# Altium schematic sheet HMI_SENSOR.SchDoc
size A4; SheetNumber: 6; SheetTotal: 6
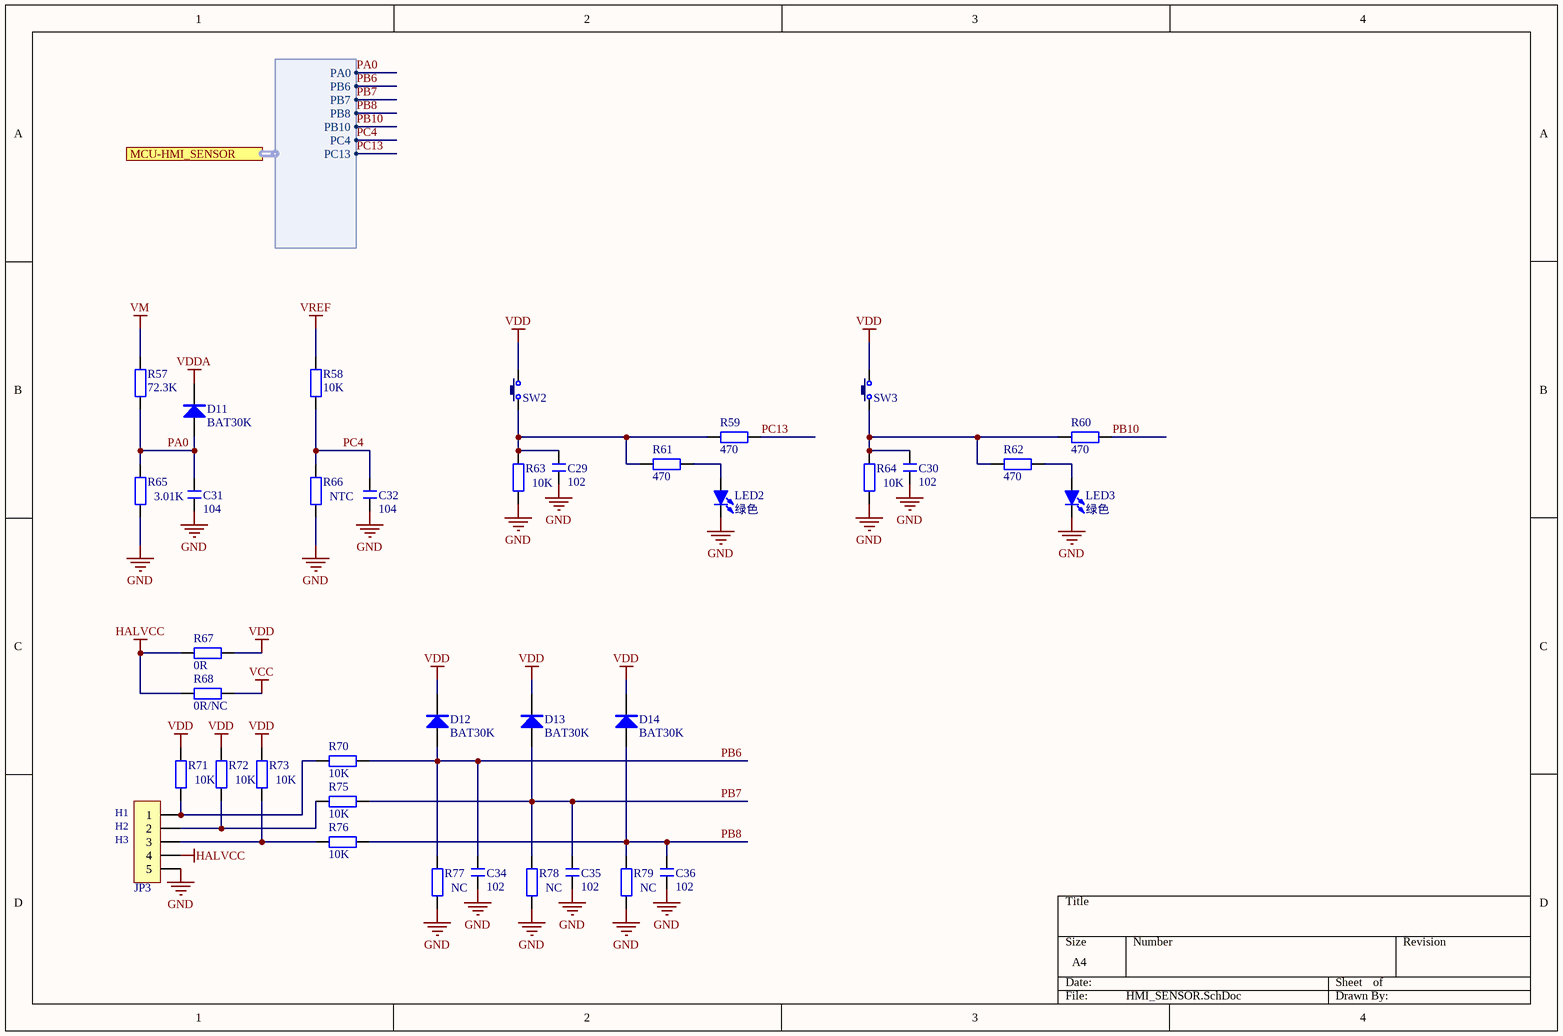
[diagram p0: HMI_SENSOR.SchDoc]

## Parts
C29  102  [C 0603_L]
C30  102  [C 0603_L]
C31  104  [C 0603_L]
C32  104  [C 0603_L]
C34  102  [C 0603_L]
C35  102  [C 0603_L]
C36  102  [C 0603_L]
D11  BAT30K  [SOD-523]
D12  BAT30K  [SOD-523]
D13  BAT30K  [SOD-523]
D14  BAT30K  [SOD-523]
JP3  HDR-1X5  [XH2.54-WI-5P]  (value not drawn)
LED2  绿色  [LED 0603G]
LED3  绿色  [LED 0603G]
R57  72.3K  [R 0603_L]
R58  10K  [R 0603_L]
R59  470  [R 0603_L]
R60  470  [R 0603_L]
R61  470  [R 0603_L]
R62  470  [R 0603_L]
R63  10K  [R 0603_L]
R64  10K  [R 0603_L]
R65  3.01K  [R 0603_L]
R66  NTC  [R 0603_M]
R67  0R  [R 0603_L]
R68  0R/NC  [R 0603_L]
R70  10K  [R 0603_L]
R71  10K  [R 0603_L]
R72  10K  [R 0603_L]
R73  10K  [R 0603_L]
R75  10K  [R 0603_L]
R76  10K  [R 0603_L]
R77  NC  [R 0603_L]
R78  NC  [R 0603_L]
R79  NC  [R 0603_L]
SW2  3x6x5  [TSW SMD-3*6*2.5]  (value not drawn)
SW3  3x6x5  [TSW SMD-3*6*2.5]  (value not drawn)

## Ports
MCU-HMI_SENSOR (harness Pow-HMI_SENSOR, see TopLevel[2D], MCU[1A])

## Harnesses
Pow-HMI_SENSOR: PA0, PB6, PB7, PB8, PB10, PC4, PC13

## Nets
GND: C29.2 C30.2 C31.2 C32.2 C34.2 C35.2 C36.2 JP3.5 LED2.2(K) LED3.2(K) R63.2 R64.2 R65.2 R66.2 R77.2 R78.2 R79.2
HALVCC: JP3.4 R67.2 R68.2
VCC: R68.1
VDD: D12.2(K) D13.2(K) D14.2(K) R67.1 R71.1 R72.1 R73.1 SW2.2 SW3.2
VDDA: D11.2(K)
VM: R57.1
VREF: R58.1
PA0: C31.1 D11.1(A) R57.2 R65.1 ; port MCU-HMI_SENSOR.PA0
PB6: C34.1 D12.1(A) R70.2 R77.1 ; port MCU-HMI_SENSOR.PB6
PB7: C35.1 D13.1(A) R75.2 R78.1 ; port MCU-HMI_SENSOR.PB7
PB8: C36.1 D14.1(A) R76.2 R79.1 ; port MCU-HMI_SENSOR.PB8
PB10: R60.2 ; port MCU-HMI_SENSOR.PB10
PC4: C32.1 R58.2 R66.1 ; port MCU-HMI_SENSOR.PC4
PC13: R59.2 ; port MCU-HMI_SENSOR.PC13
NetC29_1: C29.1 R59.1 R61.1 R63.1 SW2.1
NetC30_1: C30.1 R60.1 R62.1 R64.1 SW3.1
NetJP3_1: JP3.1 R70.1 R71.2
NetJP3_2: JP3.2 R72.2 R75.1
NetJP3_3: JP3.3 R73.2 R76.1
NetLED2_1: LED2.1(A) R61.2
NetLED3_1: LED3.1(A) R62.2

## Notes on the sheet
- (near JP3) H1
- (near JP3) H2
- (near JP3) H3

## Library data of the parts
C29-C32 C34-C36 = C: 无极性贴片电容; 版权归属: 源创客; BOM名称: 无极性贴片电容; 学习资源: www.ooocke.com
D11-D14 = SS14: 肖特基二极管; 版权归属: 源创客; 属性: 40V/1A; BOM名称: 肖特基二极管; 学习资源: www.ooocke.com
JP3 = Header 5: 5P接插件; 版权归属: 源创客; BOM名称: 5P接插件; 学习资源: www.ooocke.com
LED2 LED3 = LED-SMD: 贴片LED; 版权归属: 源创客; BOM名称: 贴片LED; 学习资源: www.ooocke.com
R57-R68 R70-R73 R75-R79 = R: 贴片电阻; 版权归属: 源创客; BOM名称: 贴片电阻; 学习资源: www.ooocke.com
SW2 SW3 = TSW 3x6: 3x6轻触开关; 版权归属: 源创客; BOM名称: 3x6轻触开关; 学习资源: www.ooocke.com